# EAGLE design TouchConnector (EAGLE 6.2)
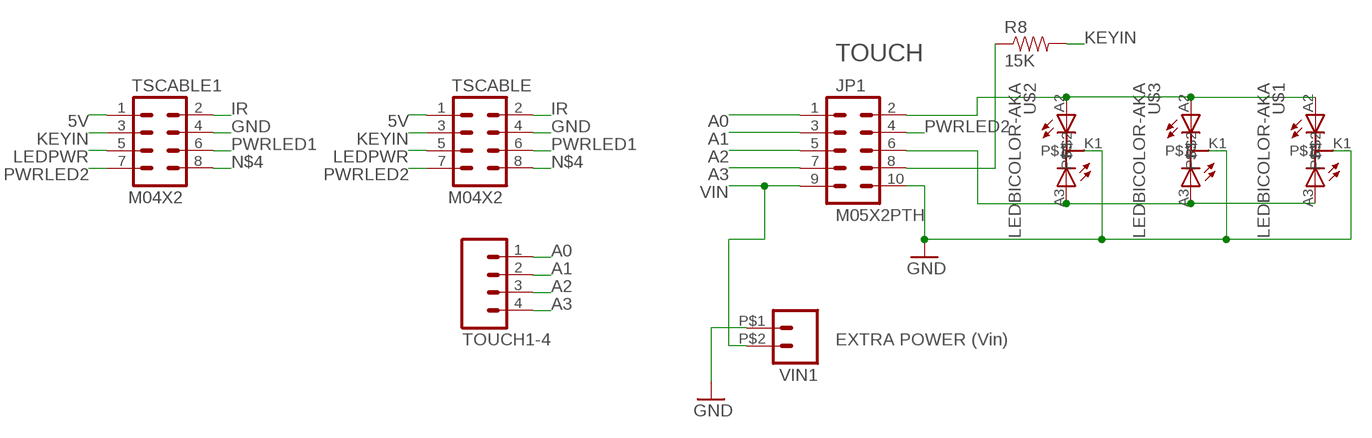
[diagram p0: schematic, sheet 1]

## Parts
JP1  M05X2PTH  [AVR_ICSP]
R8  15K  RESISTOR0603-RES  [0603-RES]
TOUCH1-4  M04PTH  [1X04]
TSCABLE  M04X2  [2X4]
TSCABLE1  M04X2  [2X4]
U$1  LEDBICOLOR-AKA  [LED5MM-BICOLOR]
U$2  LEDBICOLOR-AKA  [LED5MM-BICOLOR]
U$3  LEDBICOLOR-AKA  [LED5MM-BICOLOR]
VIN1  M02PTH2  [1X02_BIG]

## Nets
5V [Power]: TSCABLE1.1 TSCABLE.1
A0: JP1.1 TOUCH1-4.1
A1: JP1.3 TOUCH1-4.2
A2: JP1.5 TOUCH1-4.3
A3: JP1.7 TOUCH1-4.4
GND [Power]: JP1.10 TSCABLE1.4 TSCABLE.4 U$1.K1 U$2.K1 U$3.K1 VIN1.P$1
IR: TSCABLE1.2 TSCABLE.2
KEYIN: R8.2 TSCABLE1.3 TSCABLE.3
LEDPWR: TSCABLE1.5 TSCABLE.5
N$1: JP1.2 U$1.A2 U$2.A2 U$3.A2
N$2: JP1.6 U$1.A3 U$2.A3 U$3.A3
N$4: TSCABLE1.8 TSCABLE.8
N$11: JP1.8 R8.1
PWRLED1: TSCABLE1.6 TSCABLE.6
PWRLED2: JP1.4 TSCABLE1.7 TSCABLE.7
VIN [Power]: JP1.9 VIN1.P$2

## Notes on the sheet
- TOUCH
- EXTRA POWER (Vin)

## Library data of the parts
JP1 = SparkFun:M05X2: Header 5x2 Standard 10-pin dual row 0.1" header. Commonly used with AVR-ISP. Use with Spark Fun Electronics SKU: PRT-00778
R8 = SparkFun:RESISTOR: Resistor Basic schematic elements and footprints for 0603, 1206, and PTH resistors.
TOUCH1-4 = SparkFun:M04: Header 4 Standard 4-pin 0.1" header. Use with straight break away headers (SKU : PRT-00116), right angle break away headers (PRT-00553), swiss pins (PRT-00743), machine pins (PRT-00117), and female headers (PRT-00115). Molex polarized connector foot print use with SKU : PRT-08231 with associated crimp pins and housings. 1MM SMD Version SKU: PRT-10208
TSCABLE TSCABLE1 = SparkFun:M04X2
U$1-U$3 = SKAARHOJ:LEDBICOLOR-AKA
VIN1 = SparkFun:M02: Header 2 Standard 2-pin 0.1" header. Use with straight break away headers (SKU : PRT-00116), right angle break away headers (PRT-00553), swiss pins (PRT-00743), machine pins (PRT-00117), and female headers (PRT-00115). Molex polarized connector foot print use with SKU : PRT-08233 with associated crimp pins and housings.

## Net classes
0 default: width 0.203 mm, drill 0.61 mm, clearance 0.203 mm
1 Power: width 0.406 mm, drill 0.61 mm, clearance 0.305 mm

## Board
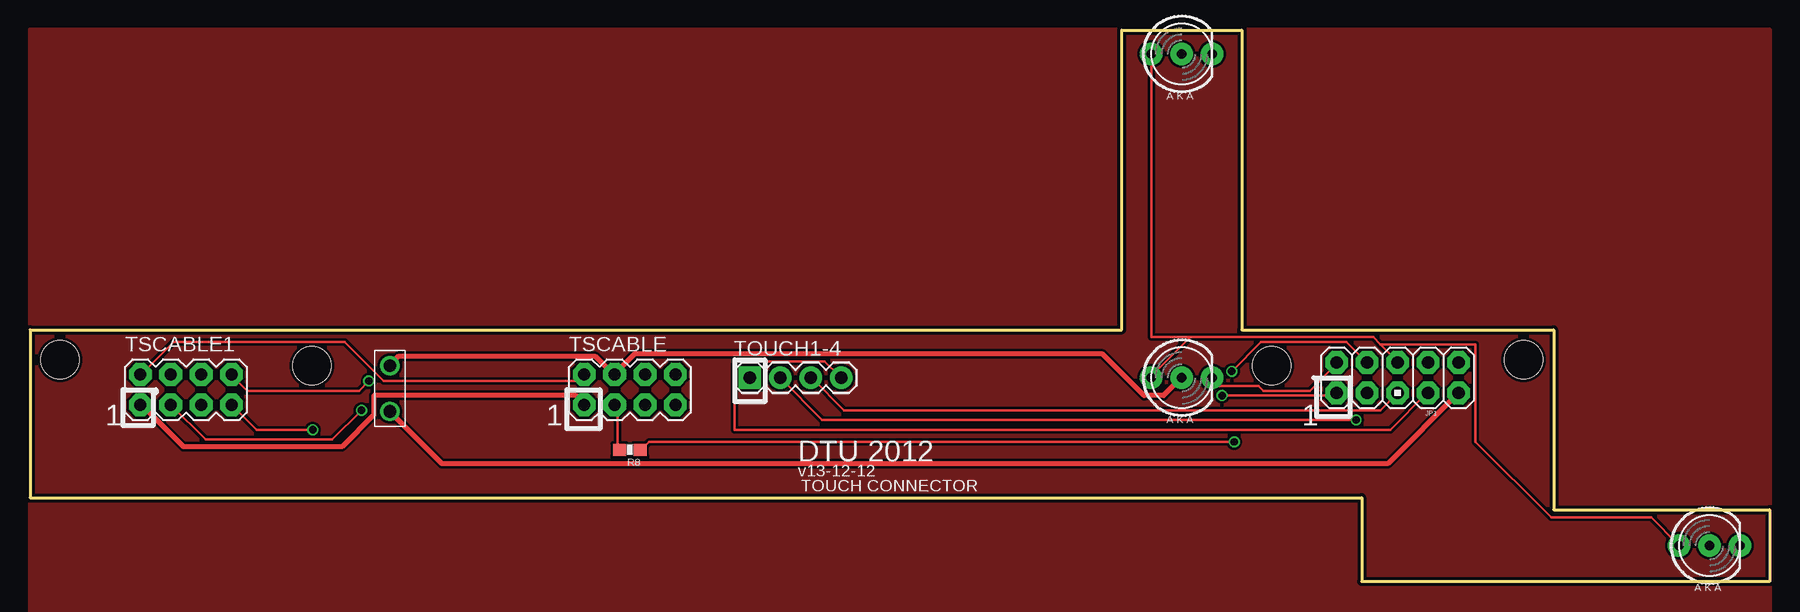
[diagram p1: board, top side]
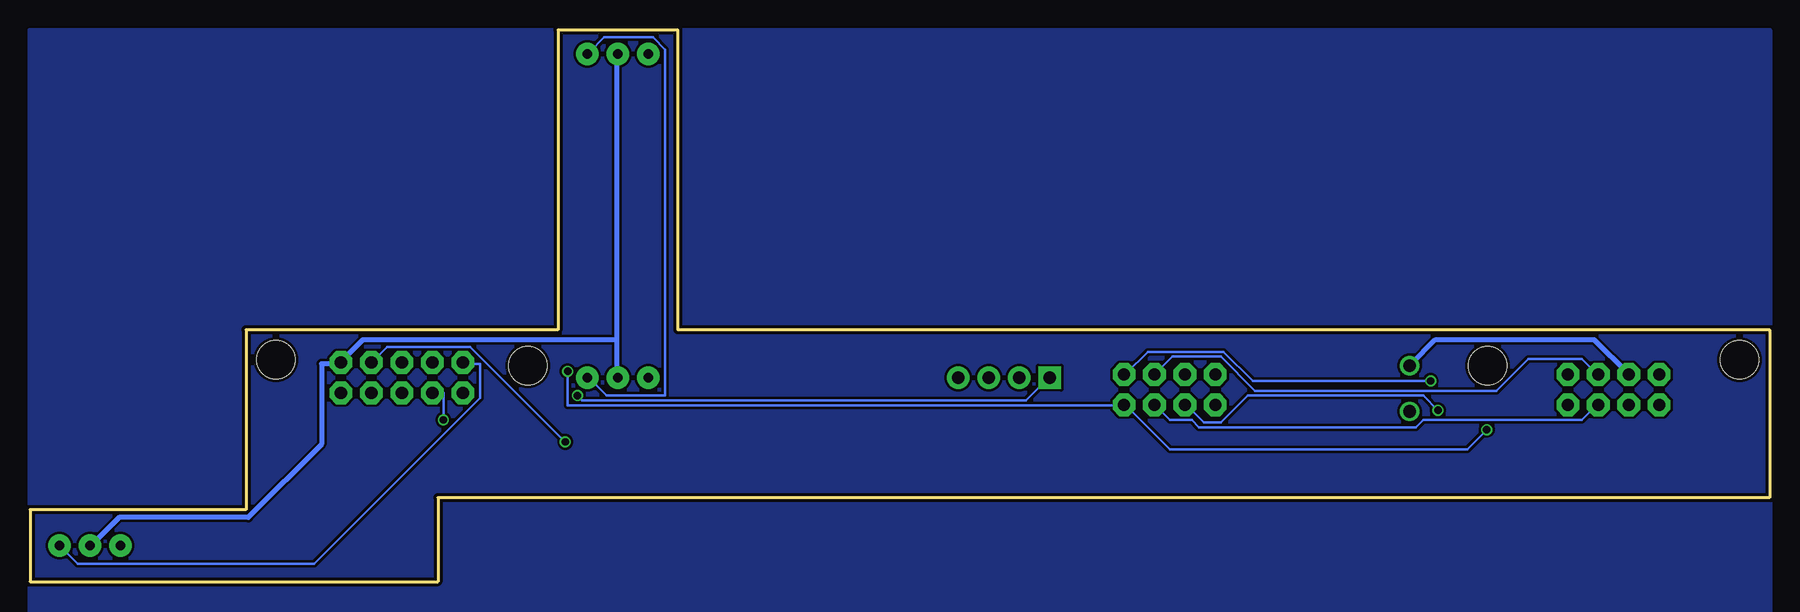
[diagram p2: board, bottom side, seen from below]

Size 145 x 46 mm. Coordinates in mm from the lower left corner, seen from the top.
Outline: 0,21 91,21 91,46 101,46 101,21 127,21 127,6 145,6 145,0 111,0 111,7 0,7 0,21
Copper layers (1*16): Top 0.035mm / dielectric 1.5mm / Bottom 0.035mm
Design rules: minimum track width 6mil, minimum drill 12mil, track to track 6mil, track to pad 6mil, pad to pad 6mil, via to via 6mil, smd to smd 0mil, copper to edge 10mil, drill to drill 10mil, minimum pad ring 10mil, minimum via ring 6mil, stop-mask expansion 2mil, vias tented up to drill 100mil, thermal gap 10mil
Holes 3.2 mm at 2.5,18.5 23.5,18 124.5,18.5 103.5,18

### Footprints (pad centres in the part's own frame; a part is rotated, then mirrored left to right if it is on the bottom)
AVR_ICSP = drill 1.016 pad 1.88 octagon: 1 -1.27,5.08; 2 1.27,5.08; 3 -1.27,2.54; 4 1.27,2.54; 5 -1.27,0; 6 1.27,0; 7 -1.27,-2.54; 8 1.27,-2.54; 9 -1.27,-5.08; 10 1.27,-5.08
0603-RES = smd 1.1 x 1: 1 -0.85,0; 2 0.85,0
1X04 = drill 1.016 pad 1.88 square: 1 0,0 | drill 1.016 pad 1.88: 2 2.54,0; 3 5.08,0; 4 7.62,0
2X4 = drill 1.016 pad 1.88 octagon: 1 -3.81,-1.27; 2 -3.81,1.27; 3 -1.27,-1.27; 4 -1.27,1.27; 5 1.27,-1.27; 6 1.27,1.27; 7 3.81,-1.27; 8 3.81,1.27
LED5MM-BICOLOR = drill 0.813 pad 1.88: A2 2.54,0; A3 -2.54,0; K1 0,0
1X02_BIG = drill 1.067: P$1 0,0; P$2 3.81,0

### Placement (x,y rotation side)
JP1  114,17 90 top
R8  50,11 180 top
TOUCH1-4  60,17 0 top
TSCABLE  50,16 0 top
TSCABLE1  13,16 0 top
U$1  96,17 0 top
U$2  96,44 0 top
U$3  140,3 0 top
VIN1  30,18 270 top

### Tracks (layer width: path | path; a pad name or v marks a point on that pad's centre or on a via)
5V
  Top 0.406: TSCABLE1.1 9.35,14.69 12.8,11.24 26.01,11.24 28.65,13.88 28.65,15.51 45.52,15.51 46.13,14.9 TSCABLE.1
A0  (via drill 0.61)
  Top 0.203: v99.36,15.51 108.71,15.51 108.92,15.71 JP1.1
  Bottom 0.203: v99.36,15.51 98.96,15.1 61.98,15.1 60.15,16.93 TOUCH1-4.1
A1  (via drill 0.61)
  Top 0.203: v110.54,13.48 66.04,13.48 62.59,16.93 TOUCH1-4.2
  Bottom 0.203: v110.54,13.48 110.54,15.71 111.35,15.71 JP1.3
A2
  Top 0.203: TOUCH1-4.3 65.23,16.93 67.87,14.29 112.57,14.29 114,15.71 JP1.5
A3
  Top 0.203: TOUCH1-4.4 67.46,17.13 66.24,18.35 58.93,18.35 58.73,18.15 58.73,12.66 113.39,12.66 116.43,15.71 JP1.7
GND
  Top 0.406: VIN1.P$1 30.07,18.15 30.68,18.76 47.14,18.76 48.56,17.34 TSCABLE.4 48.77,17.34 50.39,18.96 89.41,18.96 92.86,15.51 94.49,15.51 95.91,16.93 U$1.K1
  Bottom 0.406: TSCABLE1.4 11.79,17.34 14.63,20.18 27.84,20.18 29.87,18.15 VIN1.P$1 | 96.11,20.18 96.11,43.95 U$2.K1 | 96.11,20.18 96.11,17.13 U$1.K1 | U$3.K1 139.8,3.11 137.57,5.35 126.8,5.35 120.7,11.44 120.7,18.15 119.28,18.15 JP1.10 119.08,18.35 117.25,20.18 96.11,20.18
IR
  Top 0.203: TSCABLE1.2 9.35,17.34 11.99,19.98 26.21,19.98 29.46,16.73 45.72,16.73 46.13,17.13 TSCABLE.2
KEYIN  (via drill 0.61)
  Top 0.203: R8.2 48.97,11.04 48.97,14.69 48.77,14.69 TSCABLE.3 | v27.64,14.29 25.2,11.85 14.63,11.85 11.79,14.69 TSCABLE1.3
  Bottom 0.203: v27.64,14.29 28.85,15.51 43.48,15.51 45.72,13.27 47.14,13.27 48.56,14.69 TSCABLE.3
LEDPWR
  Bottom 0.203: TSCABLE1.5 14.43,14.69 15.65,13.48 28.85,13.48 29.46,12.87 47.55,12.87 48.16,13.48 49.99,13.48 51.21,14.69 TSCABLE.5
N$1
  Top 0.203: U$1.A2 98.55,16.93 99.16,16.32 102.41,16.32 102.82,15.91 106.68,15.91 108.92,18.15 JP1.2
  Bottom 0.203: U$2.A2 98.35,44.16 97.13,45.38 93.07,45.38 92.05,44.36 92.05,15.51 96.93,15.51 98.35,16.93 U$1.A2 | U$3.A2 142.44,2.91 141.02,1.49 121.31,1.49 107.49,15.3 107.49,18.15 108.92,18.15 JP1.2
N$2
  Top 0.203: 96.72,20.38 93.47,17.13 U$1.A3 | 96.72,20.38 111.96,20.38 112.57,19.77 | 112.57,19.77 114,18.35 JP1.6 | 96.72,20.38 93.47,20.38 93.47,43.95 U$2.A3 | 112.57,19.77 120.5,19.77 120.5,11.65 126.8,5.35 135.13,5.35 137.36,3.11 U$3.A3
N$3
  pour Top: 0,-4 145,-4 145,46 0,46
N$4  (via drill 0.61)
  Top 0.203: v28.25,16.73 27.43,15.91 18.09,15.91 16.87,17.13 TSCABLE1.8
  Bottom 0.203: v28.25,16.73 43.08,16.73 45.52,19.16 51.82,19.16 53.65,17.34 TSCABLE.8
N$5
  pour Bottom: 0,-4 145,-4 145,46 0,46
N$11  (via drill 0.61)
  Top 0.203: v100.38,11.65 51.61,11.65 51,11.04 R8.1
  Bottom 0.203: v100.38,11.65 108.31,19.57 115.21,19.57 116.43,18.35 JP1.8
PWRLED1
  Bottom 0.203: TSCABLE1.6 14.43,17.34 15.65,18.55 20.12,18.55 22.76,15.91 42.88,15.91 45.72,18.76 49.78,18.76 51.21,17.34 TSCABLE.6
PWRLED2  (via drill 0.61)
  Top 0.203: v23.57,12.66 18.9,12.66 16.87,14.69 TSCABLE1.7 | v100.18,17.54 102.62,19.98 109.73,19.98 111.35,18.35 JP1.4
  Bottom 0.203: v23.57,12.66 25.2,11.04 49.99,11.04 53.65,14.69 TSCABLE.7 53.85,14.69 100.18,14.69 v100.18,17.54
VIN
  Top 0.406: VIN1.P$2 30.07,14.09 34.34,9.82 113.18,9.82 119.08,15.71 JP1.9

### Text on the board
_tsilk: 1 | 1 | 1 | DTU 2012 | v13-12-12 | TOUCH CONNECTOR